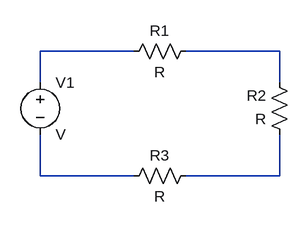
[diagram p0: schematic Draft2.asc]
Draft2.asc, the LTspice schematic file:
Version 4
SHEET 1 880 680
WIRE 272 0 128 0
WIRE 496 0 352 0
WIRE 128 48 128 0
WIRE 496 48 496 0
WIRE 128 192 128 128
WIRE 272 192 128 192
WIRE 496 192 496 128
WIRE 496 192 352 192
SYMBOL voltage 128 32 R0
SYMATTR InstName V1
SYMBOL res 368 -16 R90
WINDOW 0 0 56 VBottom 2
WINDOW 3 32 56 VTop 2
SYMATTR InstName R1
SYMBOL res 512 144 R180
WINDOW 0 36 76 Left 2
WINDOW 3 36 40 Left 2
SYMATTR InstName R2
SYMBOL res 256 208 R270
WINDOW 0 32 56 VTop 2
WINDOW 3 0 56 VBottom 2
SYMATTR InstName R3

The netlist it stands for:
* Draft2.asc
V1 N001 N003 V
R1 N002 N001 R
R2 N004 N002 R
R3 N003 N004 R
.backanno
.end